# Altium schematic sheet pilar_2.SchDoc
size 420 x 297 mm; Address1: Address1; Address2: Address2; Address3: Address3; Address4: Address4; DocumentNumber: АБВГ.123456.001 Э3; SheetNumber: 1; Scale: 1:1; DocumentType: Схема электрическая принципиальная; FirstReferrence: АБВГ.123456.001
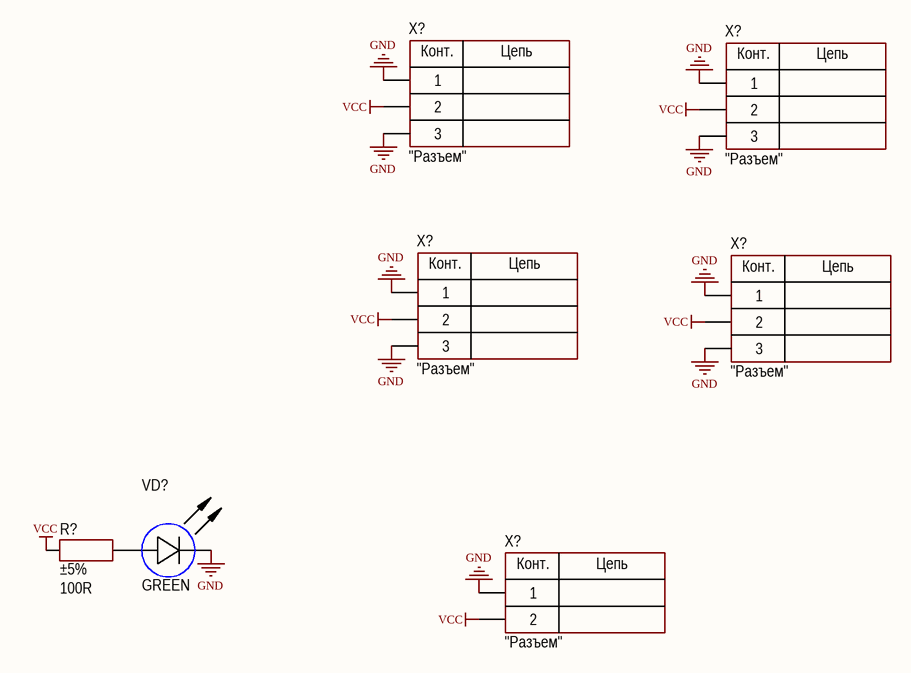
[diagram p0: pilar_2.SchDoc]

## Parts
(Parts that share a designator on the sheet are numbered #1, #2 ... from top to bottom, then left to right.)
R?  value 100R  Tolerance: ±5%  [RES: 0603]
VD?  Color: GREEN  [LED: 1206B]
X?#1  CommentText: "Разъем"  [CON: PLS-3]
X?#2  CommentText: "Разъем"  [CON: PLS-3]
X?#3  CommentText: "Разъем"  [CON: PLS-3]
X?#4  CommentText: "Разъем"  [CON: PLS-3]
X?#5  CommentText: "Разъем"  [2PLS right angle]

## Nets
GND: VD?.2(C) X?#1.1 X?#1.3 X?#2.1 X?#2.3 X?#3.1 X?#3.3 X?#4.1 X?#4.3 X?#5.1
VCC: R?.1 X?#1.2 X?#2.2 X?#3.2 X?#4.2 X?#5.2
NetR?_2: R?.2 VD?.1(A)

## Notes on the sheet
- Перв. примен.
- Справ. №
- Подп. и дата
- Инв. № дубл.
- Взам. инв. №
- Разраб.
- Изм.
- Лист
- № докум.
- Подп.
- Дата
- Лит.
- Масса
- Масштаб
- Пров.
- Т.контр.
- Листов
- Инв. № подл.
- Утв.
- Н.контр.
- 2.106-A3
- Копировал
- Формат А3
- (in symbol PLS-2) Конт.; Цепь
- (in symbol PLS-3) Конт.; Цепь

## Library data of the parts
R? = Resistor_0603: Manufacturer: Yageo; PartNumber: RC0603JR-07100RL; ValueManufacturerPartNumber: Resistor film, 100R, ±5%, 0603, 0.1W, -55...+125°C; TypeResistor: Resistor film; Power: 0.1W; Package: 0603; HelpURL: https://www.digikey.com/product-detail/en/yageo/RC0603JR-07100RL/311-100GRCT-ND/729644; Temperature: -55...+125°C
VD? = LED_single: ValueManufacturerPartNumber: LED, *, *, *, -55...+150°C; TypeDiode: LED; Manufacturer: *; Package: *; HelpURL: *; Temperature: -55...+150°C; Current: *; VoltageDrop: *; PartNumber: *
X?#1-X?#4 = PLS-3: Manufacturer: Connfly; ValueManufacturerPartNumber: Connector, 3pin, 2.54mm, 500VAC, 3A; TypeConnector: Connector; VoltageMax: 500VAC; Pitch: 2.54mm; CurrentMax: 3A; Multichannel: 3pin; HelpURL: https://www.chipdip.ru/product/pls-3; PartNumber: PLS-3
X?#5 = PLS-2: Manufacturer: Connfly; ValueManufacturerPartNumber: Connector, 2pin, 2.54mm, 500VAC, 3A; TypeConnector: Connector; VoltageMax: 500VAC; Pitch: 2.54mm; CurrentMax: 3A; Multichannel: 2pin; HelpURL: https://www.chipdip.ru/product/pls-2; PartNumber: PLS-2